# Altium schematic sheet CPU_EBI1_FPGA_Memory.SchDoc: CPU_EBI1_FPGA_Memory
size A3; Date: 18/06/2014; DrawnBy: J. Gabriel R.E.; Organization: Seven Solutions S.L.; Address1: C/Baza, Parcela 19, Nave 3; Address2: Polнgono Ind. Juncaril; Address3: 18210-Peligros-Granada; Address4: Spain; Revision: 3.4; SheetNumber: 5; SheetTotal: 23; WebAddress: www.sevensols.com; Project: White Rabbit; ProjectName: Project Name
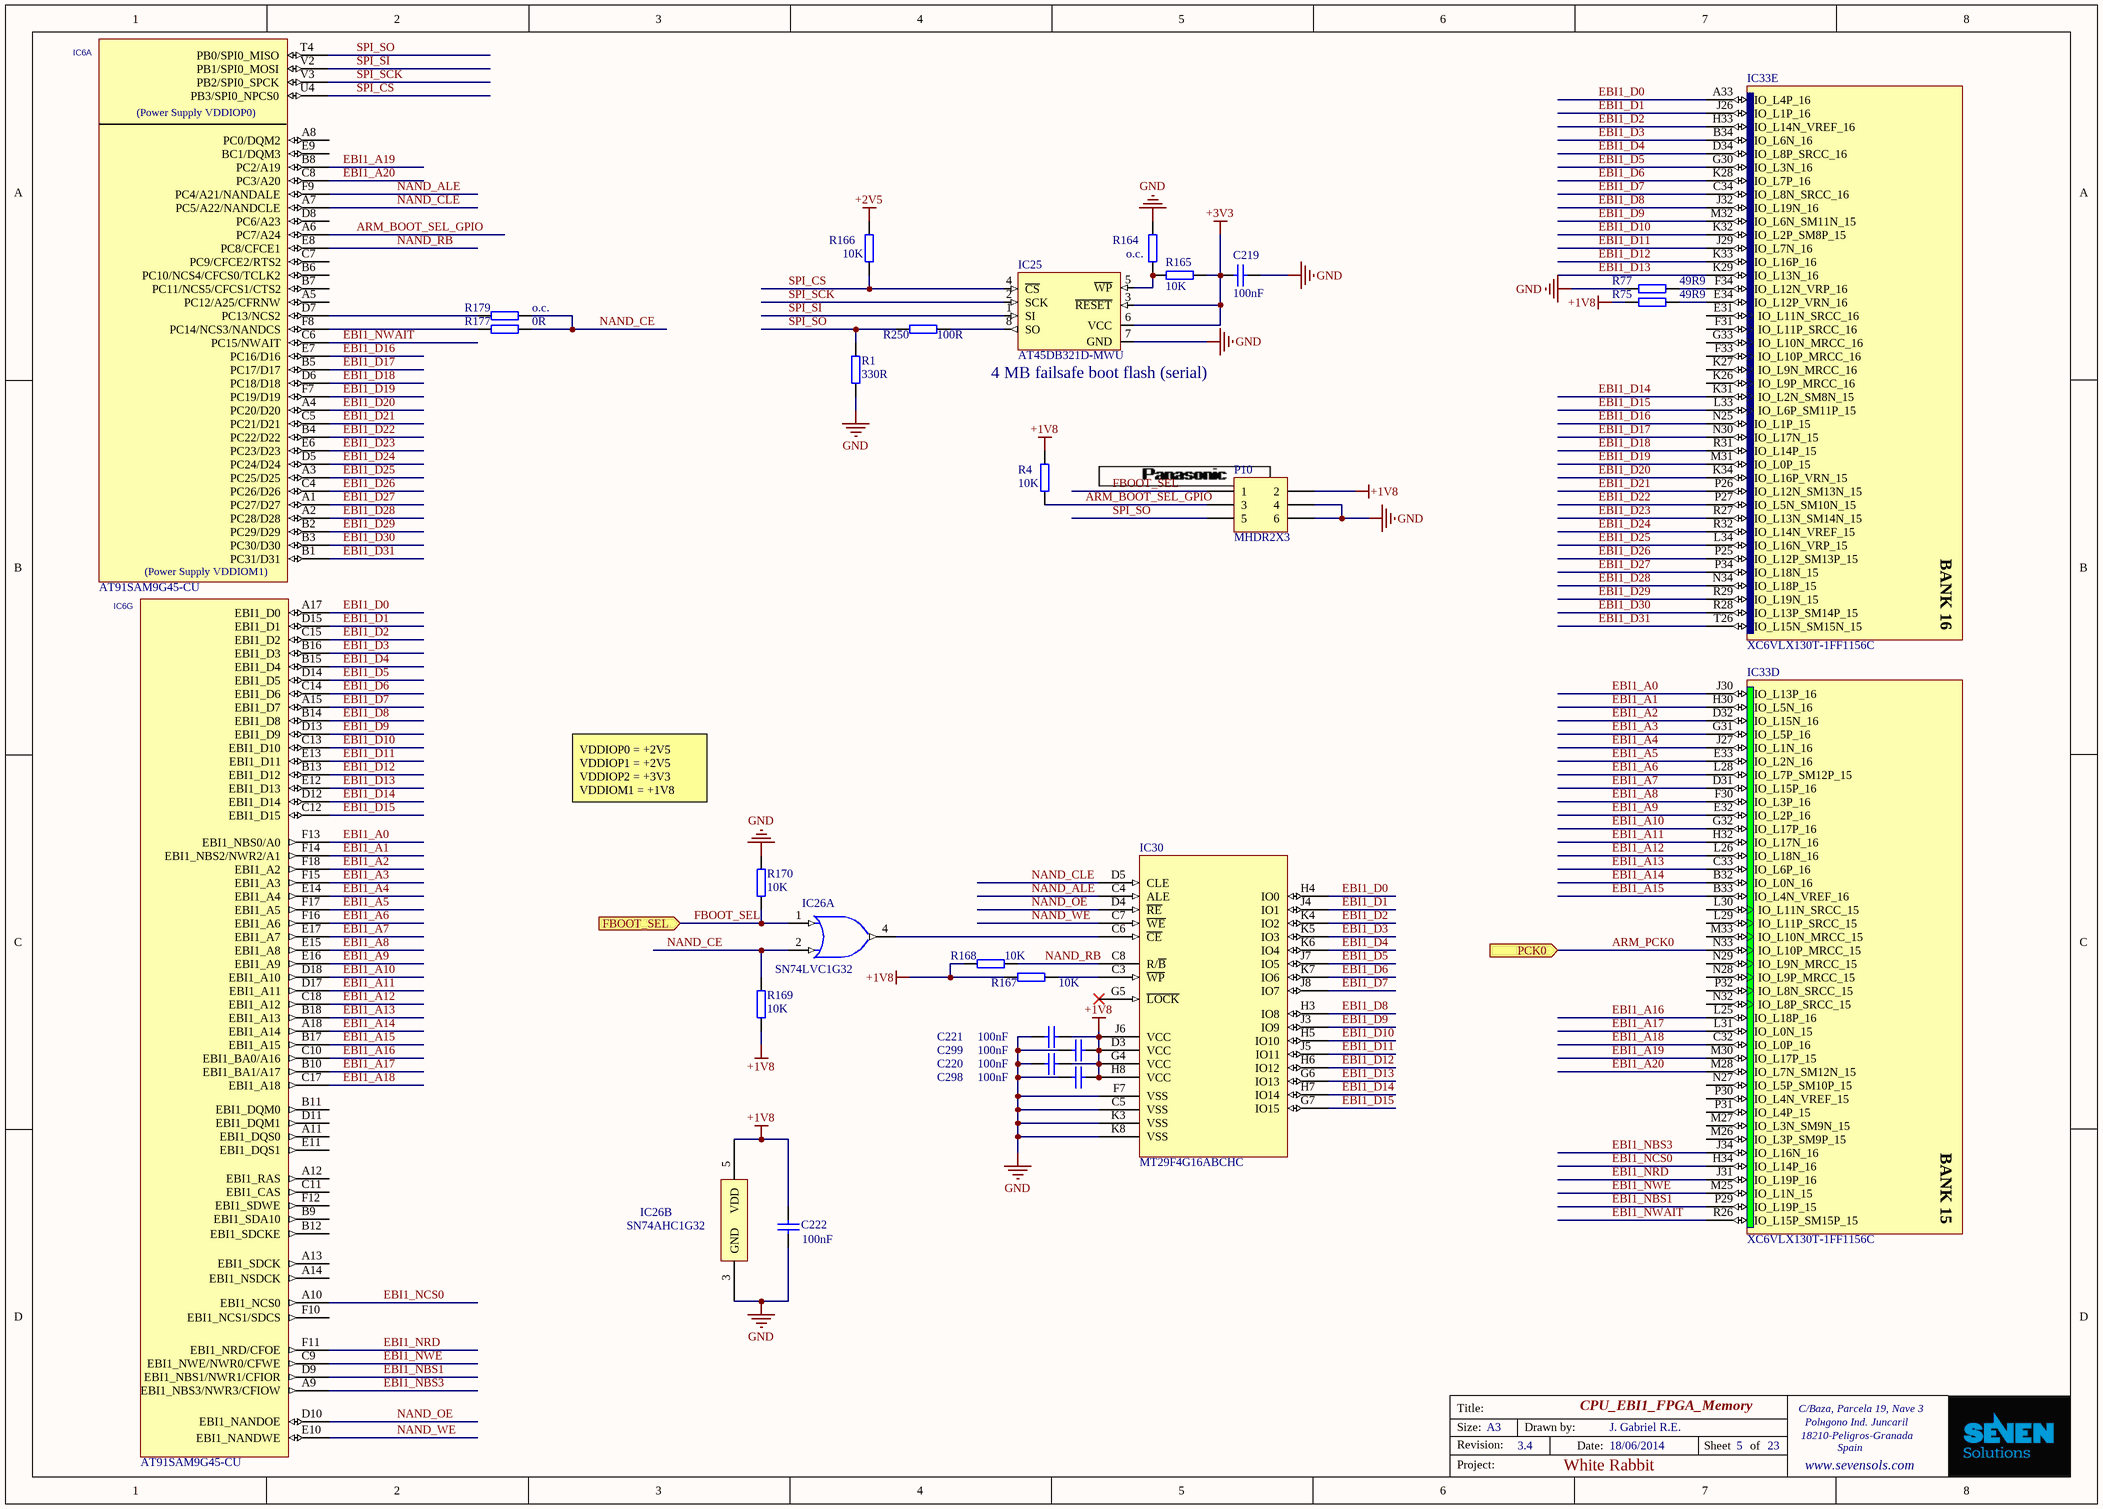
[diagram p0: CPU_EBI1_FPGA_Memory.SchDoc]

## Parts
C219  100nF  [CC1005-0402]
C220  100nF  [CC1005-0402]
C221  100nF  [CC1005-0402]
C222  100nF  [CC1005-0402]
C298  100nF  [CC1005-0402]
C299  100nF  [CC1005-0402]
IC6  AT91SAM9G45-CU  [TFBGA324]  (parts A,G of 12)
IC25  AT45DB321D-MWU  [8MW_8CN3_Merge]
IC26  SN74LVC1G32  [SOT23-5AL]  (parts A,B of 2)
IC30  MT29F4G16ABCHC  [VFBGA63]
IC33  XC6VLX130T-1FF1156C  [FF1156]  (parts D,E of 20)
P10  MHDR2X3  [MHDR2X3_1.27mm]
R1  330R  [0402]
R4  10K  [0402]
R75  49R9  [0402]
R77  49R9  [0402]
R164  o.c.  [0402]
R165  10K  [0402]
R166  10K  [0402]
R167  10K  [0402]
R168  10K  [0402]
R169  10K  [0402]
R170  10K  [0402]
R177  0R  [0603]
R179  o.c.  [0402]
R250  100R  [0402]

## Ports
FBOOT_SEL (in), PCK0 (in)

## Nets
+1V8: C220.1 C221.1 C222.2 C298.1 C299.1 IC26.5(VDD) IC30.D3(VCC) IC30.G4(VCC) IC30.H8(VCC) IC30.J6(VCC) P10.2 R4.2 R75.2 R167.2 R168.2 R169.2
+2V5: R166.2
+3V3: C219.1 IC25.3(~{RESET}) IC25.6(VCC) R165.2
GND: C219.2 C220.2 C221.2 C222.1 C298.2 C299.2 IC25.7(GND) IC26.3(GND) IC30.C5(VSS) IC30.F7(VSS) IC30.K3(VSS) IC30.K8(VSS) P10.4 P10.6 R1.1 R77.2 R164.1 R170.2
ARM_BOOT_SEL_GPIO: IC6.A6(PC7/A24) P10.3 R4.1
ARM_PCK0: IC33.N33(IO_L10P_MRCC_15) ; port PCK0
EBI1_A0: IC6.F13(EBI1_NBS0/A0) IC33.J30(IO_L13P_16)
EBI1_A1: IC6.F14(EBI1_NBS2/NWR2/A1) IC33.H30(IO_L5N_16)
EBI1_A2: IC6.F18(EBI1_A2) IC33.D32(IO_L15N_16)
EBI1_A3: IC6.F15(EBI1_A3) IC33.G31(IO_L5P_16)
EBI1_A4: IC6.E14(EBI1_A4) IC33.J27(IO_L1N_16)
EBI1_A5: IC6.F17(EBI1_A5) IC33.E33(IO_L2N_16)
EBI1_A6: IC6.F16(EBI1_A6) IC33.L28(IO_L7P_SM12P_15)
EBI1_A7: IC6.E17(EBI1_A7) IC33.D31(IO_L15P_16)
EBI1_A8: IC6.E15(EBI1_A8) IC33.F30(IO_L3P_16)
EBI1_A9: IC6.E16(EBI1_A9) IC33.E32(IO_L2P_16)
EBI1_A10: IC6.D18(EBI1_A10) IC33.G32(IO_L17P_16)
EBI1_A11: IC6.D17(EBI1_A11) IC33.H32(IO_L17N_16)
EBI1_A12: IC6.C18(EBI1_A12) IC33.L26(IO_L18N_16)
EBI1_A13: IC6.B18(EBI1_A13) IC33.C33(IO_L6P_16)
EBI1_A14: IC6.A18(EBI1_A14) IC33.B32(IO_L0N_16)
EBI1_A15: IC6.B17(EBI1_A15) IC33.B33(IO_L4N_VREF_16)
EBI1_A16: IC6.C10(EBI1_BA0/A16) IC33.L25(IO_L18P_16)
EBI1_A17: IC6.B10(EBI1_BA1/A17) IC33.L31(IO_L0N_15)
EBI1_A18: IC6.C17(EBI1_A18) IC33.C32(IO_L0P_16)
EBI1_A19: IC6.B8(PC2/A19) IC33.M30(IO_L17P_15)
EBI1_A20: IC6.C8(PC3/A20) IC33.M28(IO_L7N_SM12N_15)
EBI1_D0: IC6.A17(EBI1_D0) IC30.H4(IO0) IC33.A33(IO_L4P_16)
EBI1_D1: IC6.D15(EBI1_D1) IC30.J4(IO1) IC33.J26(IO_L1P_16)
EBI1_D2: IC6.C15(EBI1_D2) IC30.K4(IO2) IC33.H33(IO_L14N_VREF_16)
EBI1_D3: IC6.B16(EBI1_D3) IC30.K5(IO3) IC33.B34(IO_L6N_16)
EBI1_D4: IC6.B15(EBI1_D4) IC30.K6(IO4) IC33.D34(IO_L8P_SRCC_16)
EBI1_D5: IC6.D14(EBI1_D5) IC30.J7(IO5) IC33.G30(IO_L3N_16)
EBI1_D6: IC6.C14(EBI1_D6) IC30.K7(IO6) IC33.K28(IO_L7P_16)
EBI1_D7: IC6.A15(EBI1_D7) IC30.J8(IO7) IC33.C34(IO_L8N_SRCC_16)
EBI1_D8: IC6.B14(EBI1_D8) IC30.H3(IO8) IC33.J32(IO_L19N_16)
EBI1_D9: IC6.D13(EBI1_D9) IC30.J3(IO9) IC33.M32(IO_L6N_SM11N_15)
EBI1_D10: IC6.C13(EBI1_D10) IC30.H5(IO10) IC33.K32(IO_L2P_SM8P_15)
EBI1_D11: IC6.E13(EBI1_D11) IC30.J5(IO11) IC33.J29(IO_L7N_16)
EBI1_D12: IC6.B13(EBI1_D12) IC30.H6(IO12) IC33.K33(IO_L16P_16)
EBI1_D13: IC6.E12(EBI1_D13) IC30.G6(IO13) IC33.K29(IO_L13N_16)
EBI1_D14: IC6.D12(EBI1_D14) IC30.H7(IO14) IC33.K31(IO_L2N_SM8N_15)
EBI1_D15: IC6.C12(EBI1_D15) IC30.G7(IO15) IC33.L33(IO_L6P_SM11P_15)
EBI1_D16: IC6.E7(PC16/D16) IC33.N25(IO_L1P_15)
EBI1_D17: IC6.B5(PC17/D17) IC33.N30(IO_L17N_15)
EBI1_D18: IC6.D6(PC18/D18) IC33.R31(IO_L14P_15)
EBI1_D19: IC6.F7(PC19/D19) IC33.M31(IO_L0P_15)
EBI1_D20: IC6.A4(PC20/D20) IC33.K34(IO_L16P_VRN_15)
EBI1_D21: IC6.C5(PC21/D21) IC33.P26(IO_L12N_SM13N_15)
EBI1_D22: IC6.B4(PC22/D22) IC33.P27(IO_L5N_SM10N_15)
EBI1_D23: IC6.E6(PC23/D23) IC33.R27(IO_L13N_SM14N_15)
EBI1_D24: IC6.D5(PC24/D24) IC33.R32(IO_L14N_VREF_15)
EBI1_D25: IC6.A3(PC25/D25) IC33.L34(IO_L16N_VRP_15)
EBI1_D26: IC6.C4(PC26/D26) IC33.P25(IO_L12P_SM13P_15)
EBI1_D27: IC6.A1(PC27/D27) IC33.P34(IO_L18N_15)
EBI1_D28: IC6.A2(PC28/D28) IC33.N34(IO_L18P_15)
EBI1_D29: IC6.B2(PC29/D29) IC33.R29(IO_L19N_15)
EBI1_D30: IC6.B3(PC30/D30) IC33.R28(IO_L13P_SM14P_15)
EBI1_D31: IC6.B1(PC31/D31) IC33.T26(IO_L15N_SM15N_15)
EBI1_NBS1: IC6.D9(EBI1_NBS1/NWR1/CFIOR) IC33.P29(IO_L19P_15)
EBI1_NBS3: IC6.A9(EBI1_NBS3/NWR3/CFIOW) IC33.J34(IO_L16N_16)
EBI1_NCS0: IC6.A10(EBI1_NCS0) IC33.H34(IO_L14P_16)
EBI1_NRD: IC6.F11(EBI1_NRD/CFOE) IC33.J31(IO_L19P_16)
EBI1_NWAIT: IC6.C6(PC15/NWAIT) IC33.R26(IO_L15P_SM15P_15)
EBI1_NWE: IC6.C9(EBI1_NWE/NWR0/CFWE) IC33.M25(IO_L1N_15)
FBOOT_SEL: IC26.1(A) P10.1 R170.1 ; port FBOOT_SEL
NAND_ALE: IC6.F9(PC4/A21/NANDALE) IC30.C4(ALE)
NAND_CE: IC26.2(B) R169.1 R177.1 R179.1
NAND_CLE: IC6.A7(PC5/A22/NANDCLE) IC30.D5(CLE)
NAND_OE: IC6.D10(EBI1_NANDOE) IC30.D4(~{RE})
NAND_RB: IC6.E8(PC8/CFCE1) IC30.C8(R/~{B}) R168.1
NAND_WE: IC6.E10(EBI1_NANDWE) IC30.C7(~{WE})
SPI_CS: IC6.U4(PB3/SPI0_NPCS0) IC25.4(~{CS}) R166.1
SPI_SCK: IC6.V3(PB2/SPI0_SPCK) IC25.2(SCK)
SPI_SI: IC6.V2(PB1/SPI0_MOSI) IC25.1(SI)
SPI_SO: IC6.T4(PB0/SPI0_MISO) P10.5 R1.2 R250.2
NetIC6_D7: IC6.D7(PC13/NCS2) R179.2
NetIC6_F8: IC6.F8(PC14/NCS3/NANDCS) R177.2
NetIC25_5: IC25.5(~{WP}) R164.2 R165.1
NetIC25_8: IC25.8(SO) R250.1
NetIC26_4: IC26.4(Y) IC30.C6(~{CE})
NetIC30_C3: IC30.C3(~{WP}) R167.1
NetIC33_E34: IC33.E34(IO_L12P_VRN_16) R75.1
NetIC33_F34: IC33.F34(IO_L12N_VRP_16) R77.1

Not connected (* = marked no-connect by the designer): IC6 A5(PC12/A25/CFRNW) A8(PC0/DQM2) A11(EBI1_DQS0) A12(EBI1_RAS) A13(EBI1_SDCK) A14(EBI1_NSDCK) B6(PC10/NCS4/CFCS0/TCLK2) B7(PC11/NCS5/CFCS1/CTS2) B9(EBI1_SDA10) B11(EBI1_DQM0) B12(EBI1_SDCKE) C7(PC9/CFCE2/RTS2) C11(EBI1_CAS) D8(PC6/A23) D11(EBI1_DQM1) E9(BC1/DQM3) E11(EBI1_DQS1) F10(EBI1_NCS1/SDCS) F12(EBI1_SDWE); IC30 G5(~{LOCK})*; IC33 E31(IO_L11N_SRCC_16) F31(IO_L11P_SRCC_16) F33(IO_L10P_MRCC_16) G33(IO_L10N_MRCC_16) K26(IO_L9P_MRCC_16) K27(IO_L9N_MRCC_16) L29(IO_L11P_SRCC_15) L30(IO_L11N_SRCC_15) M26(IO_L3P_SM9P_15) M27(IO_L3N_SM9N_15) M33(IO_L10N_MRCC_15) N27(IO_L5P_SM10P_15) N28(IO_L9P_MRCC_15) N29(IO_L9N_MRCC_15) N32(IO_L8P_SRCC_15) P30(IO_L4N_VREF_15) P31(IO_L4P_15) P32(IO_L8N_SRCC_15)

## Notes on the sheet
- (near IC25) 4 MB failsafe boot flash (serial)
- VDDIOP0 = +2V5
  VDDIOP1 = +2V5
  VDDIOP2 = +3V3
  VDDIOM1 = +1V8
- Title:
- Size:
- Revision:
- A3
- Drawn by:
- Date:
- Sheet
- of
- Project:
- (in symbol AT91SAM9G45-CU, part A) (Power Supply VDDIOP0); (Power Supply VDDIOM1)
- (in symbol XC6VLX130T-1FF1156C, part D) BANK 15
- (in symbol XC6VLX130T-1FF1156C, part E) BANK 16

## Library data of the parts
C219-C222 C298 C299 = CC0402_100NF_16V_10%_X7R: Capacitor; Manufacturer1: TDK; Manufacturer1 PN: C1005X7R1C104K; TC: X7R; Tolerance: ±10%; Voltage: 16V; Published: 8-Jun-2000; LatestRevisionDate: 17-Jul-2002; LatestRevisionNote: Re-released for DXP Platform.; PackageReference: RAD-0.3; Publisher: Altium Limited; Distributor1: Digikey; Distributor1 PN: 445-4952-1-ND; Case: 0402; Value: 100nF
IC6 = AT91SAM9G45-CU: Atmel 400MHz ARM926 MCU; Value: AT91SAM9G45-CU; Distributor1 PN: AT91SAM9G45-CU-ND; Distributor1: Digikey
IC25 = AT45DB642D: 64-megabit 2.7V, Dual-Interface DataFlash; Value: AT45DB321D-MWU; Distributor1 PN: 556-AT45DB321D-MWU; Case: VDFN; Distributor1: Mouser
IC26 = SN74AHC1G32: TI single OR gate; RefId: 296-9847-1-ND; Value: SN74LVC1G32DBVR; Supplier: Digikey
IC30 = MT29F4G16ABCHC: NAND Flash 256Mx16, 1.8V Asynch/Page; Value: MT29F4G16ABCHC:C TR; Distributor1: Digikey; Distributor1 PN: 557-1369-1-ND
IC33 = XC6VLX130T-1FF1156C: Virtex-6 LXT Platform FPGA, 600 User I/Os, 20 GTXs, 1156-Ball FFBGA, Speed Grade 1, Commercial Grade; FirstPublished: 17-Nov-2009; DatasheetVersion: v2.0, Sep-2009; PackageVersion: ver1.0, Jun-2009; PackageReference: FF1156; Publisher: Altium Limited; PackageDescription: 1156-Ball Flip-Chip Fine Pitch Ball Grid Array (FF1156); Code_JEDEC: MS-034-AAR-1; Code_IPC: BGA100P34X34-1156; ComponentLink1Description: Virtex-6 Datasheet; ComponentLink1URL: http://www.xilinx.com/support/documentation/data_sheets/ds150.pdf; ComponentLink2Description: Pinout Specification; ComponentLink2URL: http://www.xilinx.com/support/packagefiles/virtex-6-pkgs.htm; ComponentLink3Description: FF1156 Package Drawing; ComponentLink3URL: http://www.xilinx.com/support/documentation/package_specs/ff1156.pdf; ComponentLink4Description: Virtex-6 Documents; ComponentLink4URL: http://www.xilinx.com/support/documentation/virtex-6.htm; ComponentLink5Description: Xilinx.com Home; ComponentLink5URL: http://www.xilinx.com
P10 = MHDR2X3: SMD Header, 3-Pin, Dual row, 2.54mm pitch; Manufacturer1 PN: GRPB032VWVN-RC; Manufacturer1: Sullins; Distributor1: Digikey; Distributor1 PN: S9015E-03-ND
R1 = R0402_330R_±1%_0.1W_100PPM: SMD Resistor; Manufacturer1: Panasonic; Manufacturer1 PN: ERJ-2RKF3300X; TCR: 100ppm; Power Rating: 0.1W; Tolerance: ±1%; Case: 0402; Distributor1: DigiKey; Distributor1 PN: P330LCT-ND; Value: 330R
R4 R165-R170 = R0402_10K_±1%_0.1W_100PPM: SMD Resistor; Manufacturer1: Panasonic; Manufacturer1 PN: ERJ-2RKF1002X; TCR: 100ppm; Power Rating: 0.1W; Tolerance: ±1%; Case: 0402; Distributor1: DigiKey; Distributor1 PN: P10.0KLCT-ND; Value: 10K
R75 R77 = R0402_49R9_±1%_0.1W_100PPM: SMD Resistor; Manufacturer1: Panasonic; Manufacturer1 PN: ERJ-2RKF49R9X; TCR: 100ppm; Power Rating: 0.1W; Tolerance: ±1%; Case: 0402; Distributor1: DigiKey; Distributor1 PN: P49.9LCT-ND; Value: 49R9
R164 R179 = R0402_O.C.: SMD Resistor; Mounted: No; Case: 0402; Manufacturer1: N/A; Manufacturer1 PN: N/A; Distributor1: N/A; Distributor1 PN: N/A; TCR: N/A; Power Rating: N/A; Tolerance: N/A; Value: o.c.
R177 = R0603_0R_0.1W_JUMPER: SMD Resistor; Manufacturer1: Yageo; Manufacturer1 PN: RC0603JR-070RL; TCR: 200ppm; Power Rating: 0.1W; Case: 0603; Distributor1: DigiKey; Distributor1 PN: 311-0.0GRCT-ND; Tolerance: -; Value: 0R
R250 = R0402_100R_±1%_0.1W_100PPM: SMD Resistor; Manufacturer1: Panasonic; Manufacturer1 PN: ERJ-2RKF1000X; TCR: 100ppm; Power Rating: 0.1W; Tolerance: ±1%; Case: 0402; Distributor1: DigiKey; Distributor1 PN: P100LCT-ND; Value: 100R